# Altium schematic sheet Audio_Keys.SchDoc
size A4
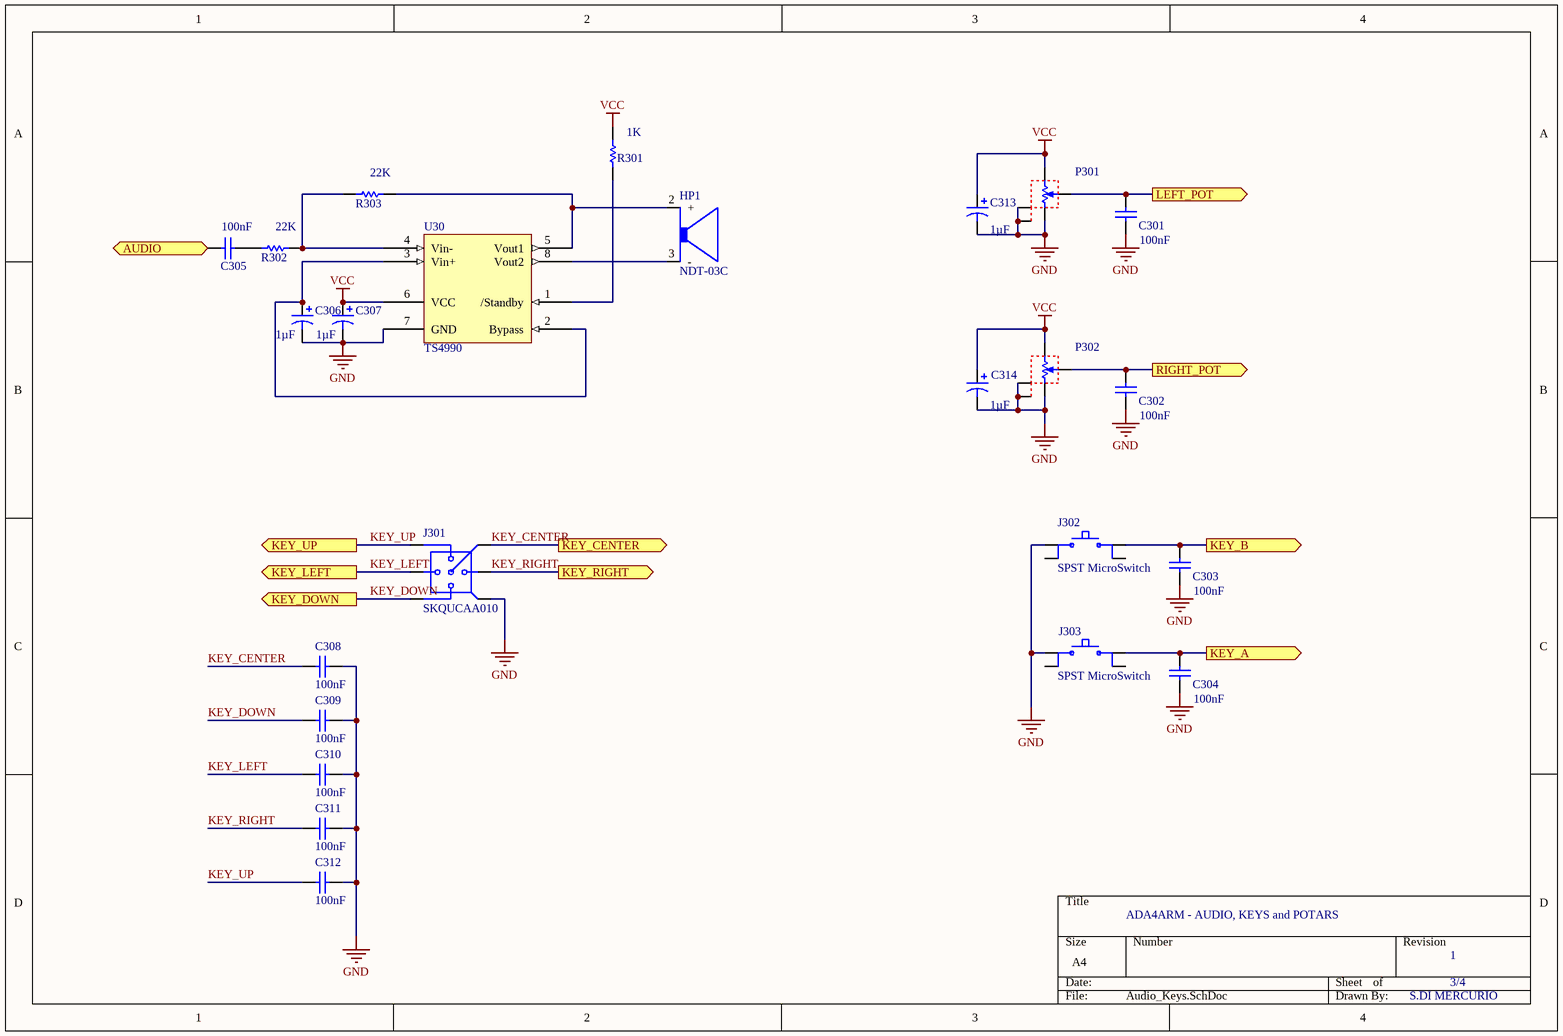
[diagram p0: Audio_Keys.SchDoc]

## Parts
C301  value 100nF  [CAPC1206(3216)100_N]  (hidden comment: CAP 100nF 16V 1206(3216))
C302  value 100nF  [CAPC1206(3216)100_N]  (hidden comment: CAP 100nF 16V 1206(3216))
C303  value 100nF  [CAPC1206(3216)100_N]  (hidden comment: CAP 100nF 16V 1206(3216))
C304  value 100nF  [CAPC1206(3216)100_N]  (hidden comment: CAP 100nF 16V 1206(3216))
C305  value 100nF  [CAPC1206(3216)100_N]  (hidden comment: CAP 100nF 16V 1206(3216))
C306  value 1µF  [EAI 3216-18 A]  (hidden comment: Cap Pol3)
C307  value 1µF  [EAI 3216-18 A]  (hidden comment: Cap Pol3)
C308  value 100nF  [CAPC1206(3216)100_N]  (hidden comment: CAP 100nF 16V 1206(3216))
C309  value 100nF  [CAPC1206(3216)100_N]  (hidden comment: CAP 100nF 16V 1206(3216))
C310  value 100nF  [CAPC1206(3216)100_N]  (hidden comment: CAP 100nF 16V 1206(3216))
C311  value 100nF  [CAPC1206(3216)100_N]  (hidden comment: CAP 100nF 16V 1206(3216))
C312  value 100nF  [CAPC1206(3216)100_N]  (hidden comment: CAP 100nF 16V 1206(3216))
C313  value 1µF  [EAI 3216-18 A]  (hidden comment: Cap Pol3)
C314  value 1µF  [EAI 3216-18 A]  (hidden comment: Cap Pol3)
HP1  NDT-03C  [KAAG15008C]
J301  SKQUCAA010  [SKQUCAA010]
J302  SPST MicroSwitch  [SPST_MicroSwitch]
J303  SPST MicroSwitch  [SPST_MicroSwitch]
P301  POT Type 51  [POT Type 51]  (value not drawn)
P302  POT Type 51  [POT Type 51]  (value not drawn)
R301  1K  [RESC1206(3216)_L]
R302  22K  [RESC1206(3216)_L]
R303  22K  [RESC1206(3216)_L]
U30  TS4990  [MiniSOP-8]

## Ports
AUDIO (in), KEY_A (out), KEY_B (out), KEY_CENTER (out), KEY_DOWN (out), KEY_LEFT (out), KEY_RIGHT (out), KEY_UP (out), LEFT_POT (out), RIGHT_POT (out)

## Nets
GND: C301.1 C302.1 C303.1 C304.1 C306.2 C307.2 C308.2 C309.2 C310.2 C311.2 C312.2 C313.2 C314.2 J301.4(COMMON) J302.1 J303.1 P301.3 P301.4(GND) P301.5(GND) P302.3 P302.4(GND) P302.5(GND) U30.7(GND)
VCC: C307.1 C313.1 C314.1 P301.1 P302.1 R301.2 U30.6(VCC)
AUDIO: C305.2 ; port AUDIO
KEY_A: C304.2 J303.3 ; port KEY_A
KEY_B: C303.2 J302.3 ; port KEY_B
KEY_CENTER: C308.1 J301.6(CENTER) ; port KEY_CENTER
KEY_DOWN: C309.1 J301.3(DOWN) ; port KEY_DOWN
KEY_LEFT: C310.1 J301.2(LEFT) ; port KEY_LEFT
KEY_RIGHT: C311.1 J301.5(RIGHT) ; port KEY_RIGHT
KEY_UP: C312.1 J301.1(UP) ; port KEY_UP
LEFT_POT: C301.2 P301.2 ; port LEFT_POT
RIGHT_POT: C302.2 P302.2 ; port RIGHT_POT
NetC305_1: C305.1 R302.1
NetC306_1: C306.1 U30.2(Bypass) U30.3(Vin+)
NetHP1_2: HP1.2(+) R303.2 U30.5(Vout1)
NetHP1_3: HP1.3(-) U30.8(Vout2)
NetR301_1: R301.1 U30.1(/Standby)
NetR302_2: R302.2 R303.1 U30.4(Vin-)

Not connected (* = marked no-connect by the designer): J302 2 4; J303 2 4

## Notes on the sheet
- ADA4ARM - AUDIO, KEYS and POTARS
- 1
- 3/4
- S.DI MERCURIO

## Library data of the parts
C301-C305 C308-C312 = CMP-1037-04185-1: CAP 100nF 16V -20% to +80% 1206 (3216 Metric) Thickness 1mm SMD; Case-EIA: 1206; Case-Metric: 3216; Max Thickness: 1 mm; Tolerance: -20% to +80%; Technology: SMT; Rated Voltage: 16 V
C306 C307 C313 C314 = Cap Pol3: Polarized Capacitor (Surface Mount); Published: 8-Jun-2000; LatestRevisionDate: 29-May-2009; LatestRevisionNote: IPC-7351 Footprint Added.; PackageReference: C0805; Publisher: Altium Limited; PackageDescription: Chip Capacitor
HP1 = NDT-03C: Audio HP
J301 = SKQUCAA010: 4 ways + center switch
J302 J303 = SPST MicroSwitch: SPST - MicroSwitch
P301 P302 = POT Type 51: 25mm Diameter potentiometer
R301-R303 = CMP-1014-00623-1: 10K 0.25W 1% 1206 (3216 Metric)  SMD; Case-Metric: 3216; Case-EIA: 1206; Power: 0.25 W; Technology: SMT; Tolerance: 1 %
  R301: Value: 1K
  R302 R303: Value: 22K